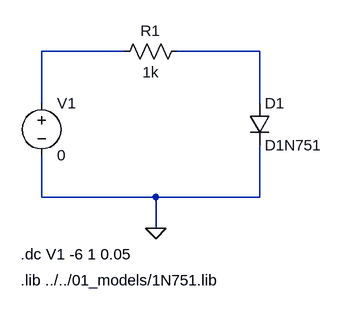
[diagram p0: schematic acdcconv_02_03_02_zener_iz_vz.asc]
acdcconv_02_03_02_zener_iz_vz.asc, the LTspice schematic file:
Version 4
SHEET 1 1308 680
WIRE 432 96 304 96
WIRE 640 96 512 96
WIRE 304 176 304 96
WIRE 640 176 640 96
WIRE 304 320 304 256
WIRE 480 320 304 320
WIRE 640 320 640 240
WIRE 640 320 480 320
WIRE 480 368 480 320
FLAG 480 368 0
SYMBOL voltage 304 160 R0
WINDOW 123 0 0 Left 2
WINDOW 39 0 0 Left 2
SYMATTR InstName V1
SYMATTR Value 0
SYMBOL diode 624 176 R0
SYMATTR InstName D1
SYMATTR Value D1N751
SYMBOL res 528 80 R90
WINDOW 0 0 56 VBottom 2
WINDOW 3 32 56 VTop 2
SYMATTR InstName R1
SYMATTR Value 1k
TEXT 272 408 Left 2 !.dc V1 -6 1 0.05
TEXT 272 448 Left 2 !.lib ../../01_models/1N751.lib

The netlist it stands for:
* acdcconv_02_03_02_zener_iz_vz.asc
V1 N001 0 0
D1 N002 0 D1N751
R1 N002 N001 1k
.model D D
.lib standard.dio
.dc V1 -6 1 0.05
.lib ../../01_models/1N751.lib
.backanno
.end